# EAGLE design satstep6600 (EAGLE 8.4.3)
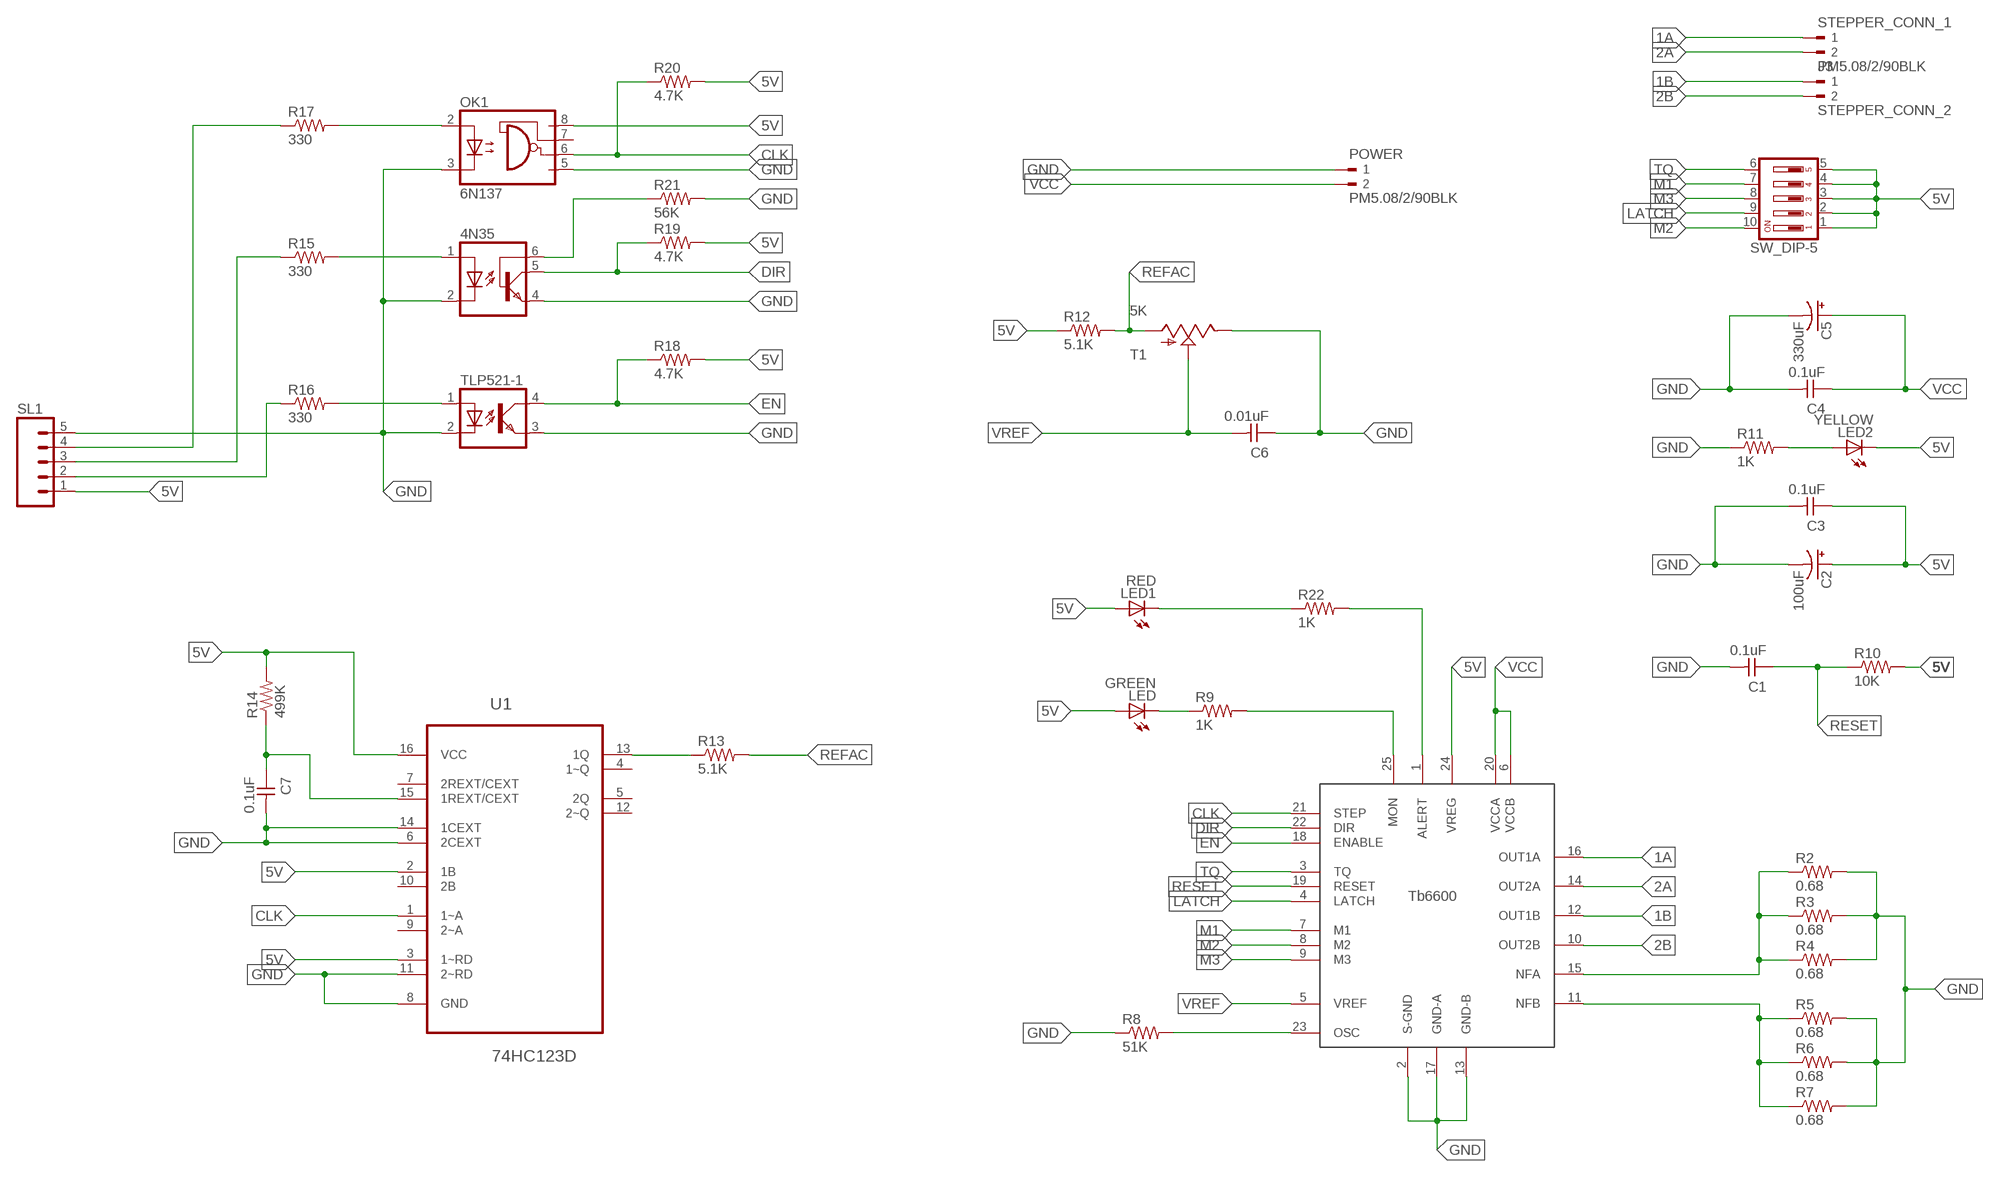
[diagram p0: schematic, sheet 1]

## Parts
4N35  4N35  [DIL06]
C1  0.1uF  UNPOLARIZED_CAPACITOR1206  [1206]
C2  100uF  CAP_POLC  [PANASONIC_C]
C3  0.1uF  UNPOLARIZED_CAPACITOR1206  [1206]
C4  0.1uF  UNPOLARIZED_CAPACITOR1206  [1206]
C5  330uF  CAP_POLPTH3  [CPOL-RADIAL-1000UF-63V]
C6  0.01uF  UNPOLARIZED_CAPACITOR1206  [1206]
C7  0.1uF  UNPOLARIZED_CAPACITOR1206  [1206]
J3  STEPPER_CONN_2  PM5.08/2/90BLK  [WEIDMULLER_PM5.08_2]
LED  GREEN  LED1206  [1206]
LED1  RED  LED1206  [1206]
LED2  YELLOW  LED1206  [1206]
OK1  6N137  [DIL08]
POWER  PM5.08/2/90BLK  [WEIDMULLER_PM5.08_2]
R2  0.68  0.001OHM-3W-1%(2512)3W/1%  [2512]
R3  0.68  0.001OHM-3W-1%(2512)3W/1%  [2512]
R4  0.68  0.001OHM-3W-1%(2512)3W/1%  [2512]
R5  0.68  0.001OHM-3W-1%(2512)3W/1%  [2512]
R6  0.68  0.001OHM-3W-1%(2512)3W/1%  [2512]
R7  0.68  0.001OHM-3W-1%(2512)3W/1%  [2512]
R8  51K  RES-US1206  [R1206]
R9  1K  RES-US1206  [R1206]
R10  10K  RES-US1206  [R1206]
R11  1K  RES-US1206  [R1206]
R12  5.1K  RES-US1206  [R1206]
R13  5.1K  RES-US1206  [R1206]
R14  499K  RES-US1206  [R1206]
R15  330  RES-US1206  [R1206]
R16  330  RES-US1206  [R1206]
R17  330  RES-US1206  [R1206]
R18  4.7K  RES-US1206  [R1206]
R19  4.7K  RES-US1206  [R1206]
R20  4.7K  RES-US1206  [R1206]
R21  56K  RES-US1206  [R1206]
R22  1K  RES-US1206  [R1206]
SL1  M05  [05P]
STEPPER_CONN_1  PM5.08/2/90BLK  [WEIDMULLER_PM5.08_2]
SW_DIP-5  SD4-05  [SD4-05]
T1  5K  TS53YL104MR10-TRIMMER  [TS53YL104MR10_TRIMMER]
TLP521-1  PC817  [DIL04]
U1  74HC123D  [SOIC127P600X175-16N]
U$1  TB6600HG  [P-HZIP25-1.00G]

## Nets
1A: STEPPER_CONN_1.1 U$1.16(OUT1A)
1B: J3.1 U$1.12(OUT1B)
2A: STEPPER_CONN_1.2 U$1.14(OUT2A)
2B: J3.2 U$1.10(OUT2B)
5V: C2.+ C3.1 LED1.1(A) LED2.2(C) LED.1(A) OK1.8(VCC) R10.2 R12.1 R14.2 R18.2 R19.2 R20.2 SL1.1 SW_DIP-5.1 SW_DIP-5.2 SW_DIP-5.3 SW_DIP-5.4 SW_DIP-5.5 U1.2(1B) U1.3(1~RD) U1.16(VCC) U$1.24(VREG)
ALERT: R22.2 U$1.1(ALERT)
CLK: OK1.6(VO) R20.1 U1.1(1~A) U$1.21(STEP)
DIR: 4N35.5(COL) R19.1 U$1.22(DIR)
EN: R18.1 TLP521-1.4(COL) U$1.18(ENABLE)
GND: 4N35.2(C) 4N35.4(EMI) C1.2 C2.- C3.2 C4.2 C5.2(-) C6.1 C7.2 OK1.3(C) OK1.5(GND) POWER.1 R2.2 R3.2 R4.2 R5.2 R6.2 R7.2 R8.1 R11.1 R21.2 SL1.5 T1.P$2(E) TLP521-1.2(C) TLP521-1.3(EMIT) U1.6(2CEXT) U1.8(GND) U1.11(2~RD) U1.14(1CEXT) U$1.2(S-GND) U$1.13(GND-B) U$1.17(GND-A)
LATCH: SW_DIP-5.9 U$1.4(LATCH)
M1: SW_DIP-5.7 U$1.7(M1)
M2: SW_DIP-5.10 U$1.8(M2)
M3: SW_DIP-5.8 U$1.9(M3)
N$1: R5.1 R6.1 R7.1 U$1.11(NFB)
N$2: R8.2 U$1.23(OSC)
N$4: LED.2(C) R9.1
N$5: R2.1 R3.1 R4.1 U$1.15(NFA)
N$6: LED1.2(C) R22.1
N$7: LED2.1(A) R11.2
N$8: R13.1 U1.13(1Q)
N$9: C7.1 R14.1 U1.15(1REXT/CEXT)
N$10: R16.2 TLP521-1.1(A)
N$11: 4N35.1(A) R15.2
N$12: OK1.2(A) R17.2
N$13: 4N35.6(BAS) R21.1
N$14: R16.1 SL1.2
N$15: R15.1 SL1.3
N$16: R17.1 SL1.4
N$19: R9.2 U$1.25(MON)
REFAC: R12.2 R13.2 T1.P$3(A)
RESET: C1.1 R10.1 U$1.19(RESET)
TQ: SW_DIP-5.6 U$1.3(TQ)
VCC: C4.1 C5.1(+) POWER.2 U$1.6(VCCB) U$1.20(VCCA)
VREF: C6.2 T1.P$1(S) U$1.5(VREF)
Unconnected: OK1.7(VE) U1.4(1~Q) U1.5(2Q) U1.7(2REXT/CEXT) U1.9(2~A) U1.10(2B) U1.12(2~Q)

## Library data of the parts
4N35 = optocoupler:4N35: MOTOROLA OPTO COUPLER
C1 C3 C4 C6 C7 = FAB_Hello:UNPOLARIZED_CAPACITOR: unpolarized_capacitor
C2 C5 = SparkFun-Capacitors:CAP_POL: Capacitor Polarized These are standard SMD and PTH capacitors. Normally 10uF, 47uF, and 100uF in electrolytic and tantalum varieties. Always verify the external diameter of the through hole cap, it varies with capacity, voltage, and manufacturer. The EIA devices should be standard.
J3 POWER STEPPER_CONN_1 = WEIDMULLER-PM5.08_2_90BLK:PM5.08/2/90BLK: TERMINAL BLOCK, SIDE ENTRY, 2WAY; MPN: PM5.08/2/90 BLK; OC_FARNELL: 1131855; OC_NEWARK: 26M1980; PACKAGE: TH-R/A; SUPPLIER: WEIDMULLER
LED LED1 LED2 = FAB_Hello:LED
OK1 = optocoupler-2:6N137: MOTOROLA OPTO COUPLER
R2-R7 = SparkFun-Resistors:0.001OHM-3W-1%(2512); PROD_ID: RES-12449; VALUE: 0.001
R8-R22 = fab:RES-US: Resistor (US Symbol) Variants with postfix FAB are widened to allow the routing of internal traces
SL1 = con-amp-quick:M05: AMP QUICK CONNECTOR; OC_FARNELL: unknown; OC_NEWARK: unknown
SW_DIP-5 = switch-dil:SD4-05: DIL/CODE SWITCH; OC_FARNELL: unknown; OC_NEWARK: unknown
T1 = Ava:TS53YL104MR10-TRIMMER
TLP521-1 = optocoupler:PC817: SHARP OPTO COUPLER
U1 = 74HC123D:74HC123D: Dual retriggerable monostable multivibrator with reset; MPN: 74HC123D; OC_FARNELL: 1085332; OC_NEWARK: 99K0580; PACKAGE: SOIC-16; SUPPLIER: NXP
U$1 = tb6600hq:TB6600

## Board
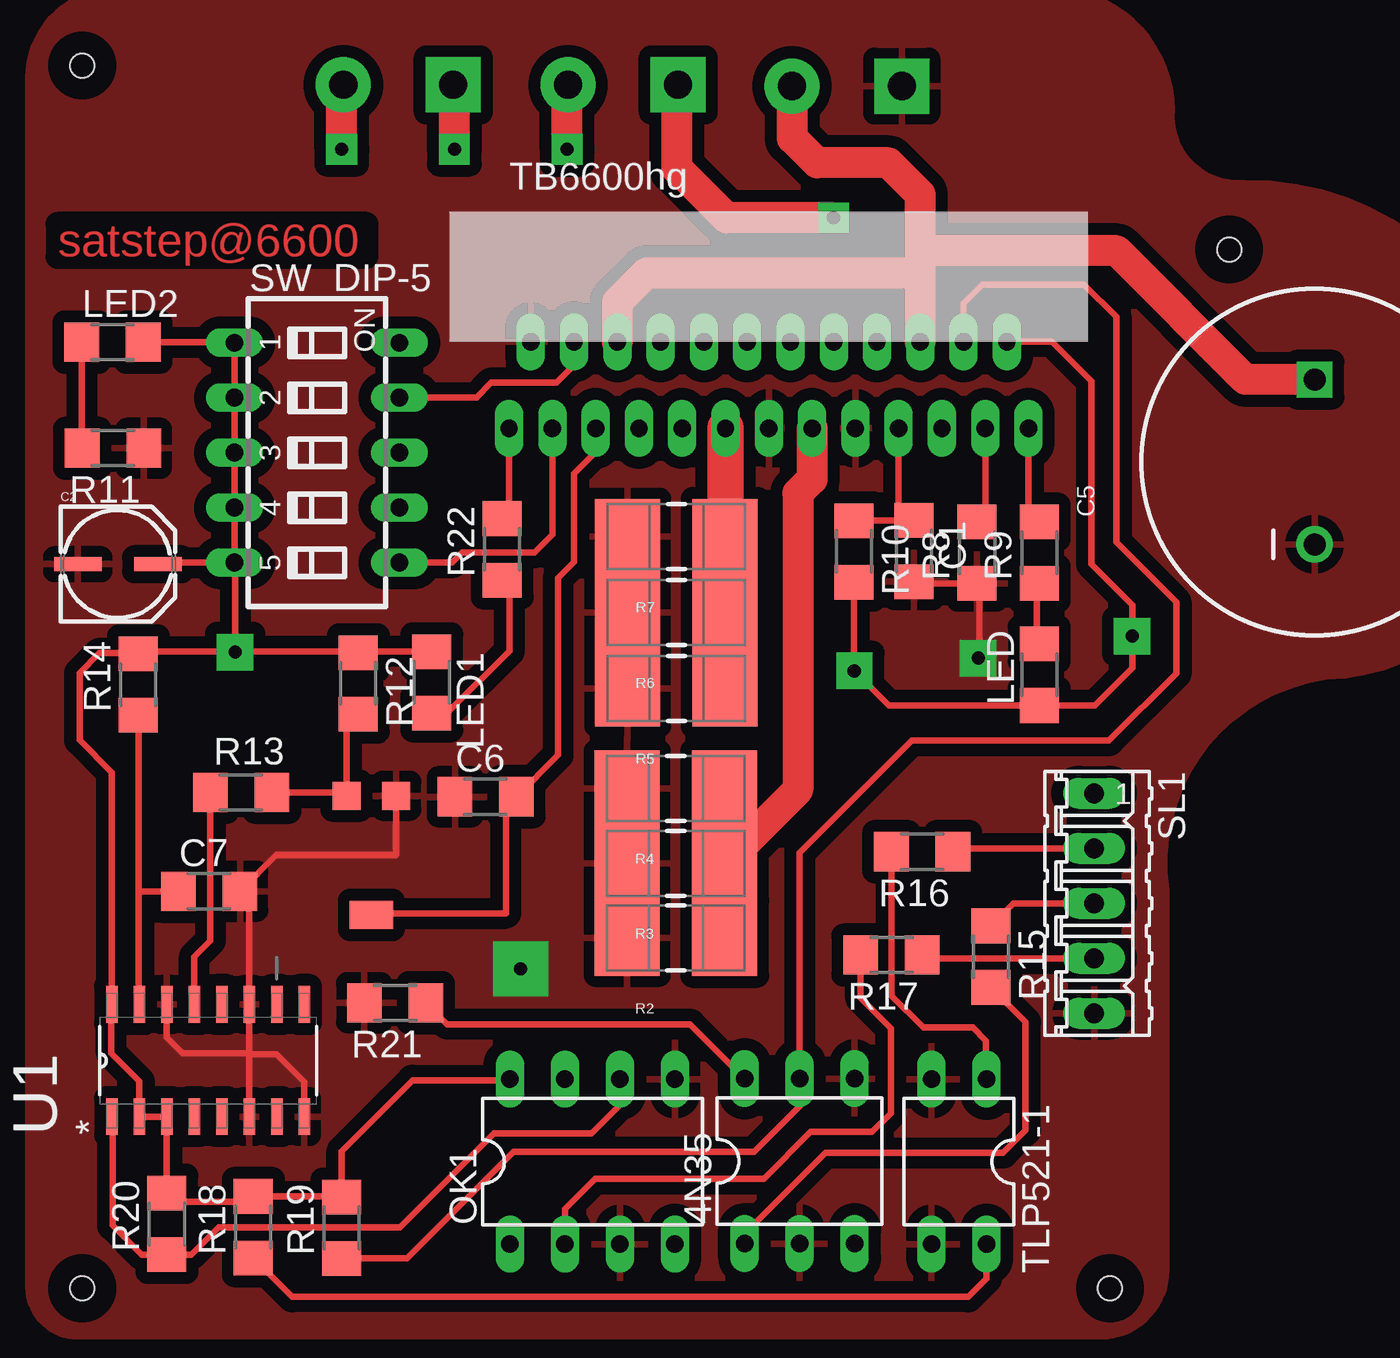
[diagram p1: board, top side]
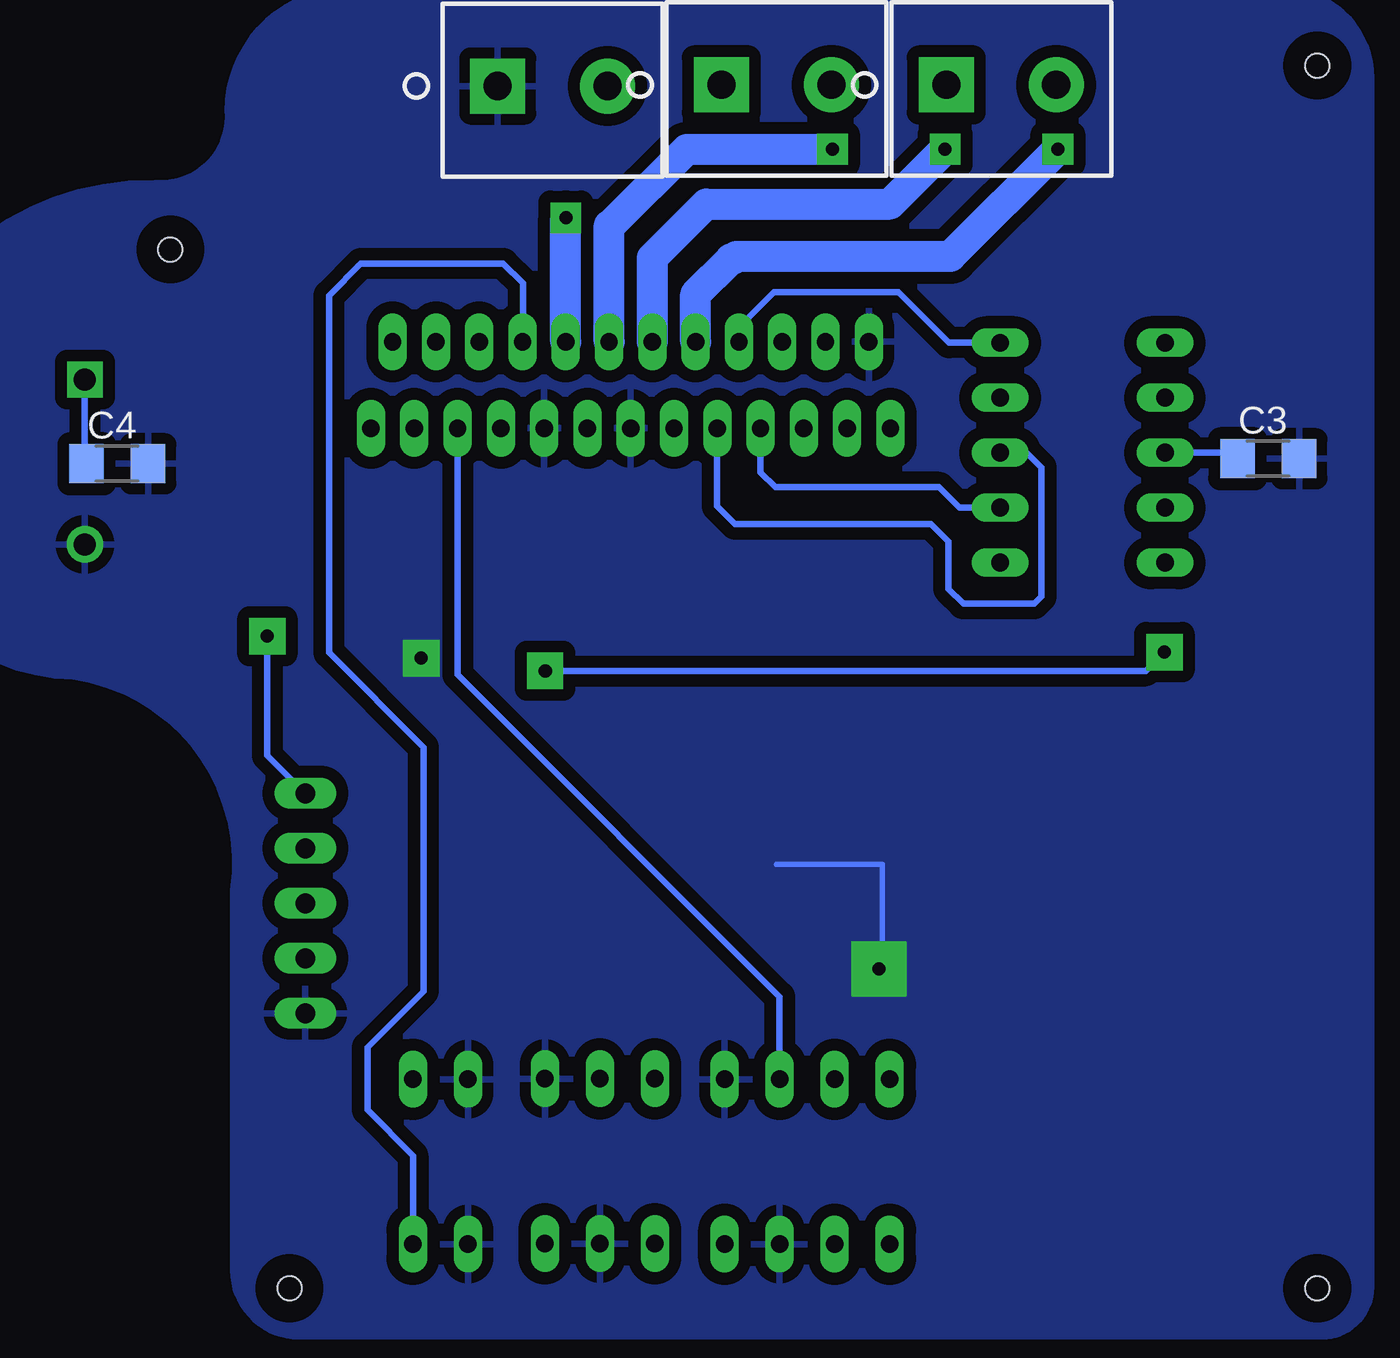
[diagram p2: board, bottom side, seen from below]

No outline drawn. Coordinates in mm, seen from the top.
Copper layers (1*16): Top 0.035mm / dielectric 1.5mm / Bottom 0.035mm
Design rules "default *": minimum track width 10mil, minimum drill 24mil, track to track 8mil, track to pad 8mil, pad to pad 8mil, via to via 8mil, smd to smd 8mil, copper to edge 40mil, drill to drill 8mil, minimum pad ring 10mil, minimum via ring 8mil, stop-mask expansion 4mil, vias tented up to drill 0mil, thermal gap 20mil
Holes 1.1 mm at 3.5,60 3.5,3.5 51,3.5 56.5,51.5

### Footprints (pad centres in the part's own frame; a part is rotated, then mirrored left to right if it is on the bottom)
DIL06 = drill 0.813 long: 1 -2.54,-3.81; 2 0,-3.81; 3 2.54,-3.81; 4 2.54,3.81; 5 0,3.81; 6 -2.54,3.81
1206 = smd 1.6 x 1.803: 1 -1.422,0; 2 1.422,0
PANASONIC_C = smd 2.2 x 0.65: + 1.9,-0.2; - -1.8,-0.2
CPOL-RADIAL-1000UF-63V = drill 1.016 pad 1.651 square: 1 3.81,0 | drill 1.016 pad 1.676: 2 -3.81,0
WEIDMULLER_PM5.08_2 = drill 1.3 pad 2.54 square: 1 -2.54,0 | drill 1.3 pad 2.54: 2 2.54,0
DIL08 = drill 0.813 long: 1 -3.81,-3.81; 2 -1.27,-3.81; 3 1.27,-3.81; 4 3.81,-3.81; 5 3.81,3.81; 6 1.27,3.81; 7 -1.27,3.81; 8 -3.81,3.81
2512 = smd 3 x 3.5: 1 -2.25,0; 2 2.25,0
R1206 = smd 1.6 x 1.803: 1 -1.422,0; 2 1.422,0
05P = drill 0.914 long: 1 -5.08,0; 2 -2.54,0; 3 0,0; 4 2.54,0; 5 5.08,0
SD4-05 = drill 0.813 long: 1 -5.08,-3.81; 2 -2.54,-3.81; 3 0,-3.81; 4 2.54,-3.81; 5 5.08,-3.81; 6 5.08,3.81; 7 2.54,3.81; 8 0,3.81; 9 -2.54,3.81; 10 -5.08,3.81
TS53YL104MR10_TRIMMER = smd 2 x 1.3: P$1 0,2.54 | smd 1.3 x 1.3: P$2 -1.15,-2.96; P$3 1.15,-2.96
DIL04 = drill 0.813 long: 1 -1.27,-3.81; 2 1.27,-3.81; 3 1.27,3.81; 4 -1.27,3.81
SOIC127P600X175-16N = smd 1.702 x 0.533: 1 -2.591,4.445; 2 -2.591,3.175; 3 -2.591,1.905; 4 -2.591,0.635; 5 -2.591,-0.635; 6 -2.591,-1.905; 7 -2.591,-3.175; 8 -2.591,-4.445; 9 2.591,-4.445; 10 2.591,-3.175; 11 2.591,-1.905; 12 2.591,-0.635; 13 2.591,0.635; 14 2.591,1.905; 15 2.591,3.175; 16 2.591,4.445
P-HZIP25-1.00G = drill 0.8 long: 1 -12,-2; 2 -11,2; 3 -10,-2; 4 -9,2; 5 -8,-2; 6 -7,2; 7 -6,-2; 8 -5,2; 9 -4,-2; 10 -3,2; 11 -2,-2; 12 -1,2; 13 0,-2; 14 1,2; 15 2,-2; 16 3,2; 17 4,-2; 18 5,2; 19 6,-2; 20 7,2; 21 8,-2; 22 9,2; 23 10,-2; 24 11,2; 25 12,-2

### Placement (x,y rotation side)
4N35  36.65,9.37 0 top
C1  41.94,37.57 270 top
C2  5.11,37.16 0 top
C3  5.77,41.83 0 bottom
C4  58.95,41.61 0 bottom
C5  60.45,41.68 90 top
C6  22.15,26.21 0 top
C7  9.37,21.84 0 top
J3  18.11,59.11 0 bottom
LED  47.73,31.85 90 top
LED1  19.66,31.5 270 top
LED2  4.9,47.22 0 top
OK1  27.08,9.35 0 top
POWER  38.84,59.05 0 bottom
R2  30.94,19.68 180 top
R3  30.94,23.14 180 top
R4  30.94,26.59 180 top
R5  30.96,31.22 180 top
R6  30.96,34.72 180 top
R7  30.96,38.23 180 top
R8  44.86,37.49 90 top
R9  47.73,37.49 90 top
R10  39.17,37.54 270 top
R11  4.93,42.32 180 top
R12  16.26,31.45 270 top
R13  10.85,26.42 0 top
R14  6.1,31.39 90 top
R15  45.49,18.82 270 top
R16  42.32,23.67 180 top
R17  40.89,18.9 180 top
R18  11.4,6.32 90 top
R19  15.49,6.3 90 top
R20  7.42,6.48 90 top
R21  17.96,16.69 180 top
R22  22.91,37.64 90 top
SL1  50.27,21.29 270 top
STEPPER_CONN_1  28.5,59.11 0 bottom
SW_DIP-5  14.35,42.11 270 top
T1  16.87,23.29 180 top
TLP521-1  44.02,9.35 180 top
U1  9.32,14.02 90 top
U$1  35.23,45.24 0 top

### Tracks (layer width: path | path; a pad name or v marks a point on that pad's centre or on a via)
1A  (via drill 0.6 pad 1.42)
  Top 1.422: v38.23,52.96 33.27,52.96 30.99,55.24 30.99,59.05 STEPPER_CONN_1.1
  Bottom 1.422: U$1.16 v38.23,52.96
1B  (via drill 0.6 pad 1.42)
  Top 1.422: v20.7,56.13 20.7,59.11 J3.1
  Bottom 1.422: U$1.12 34.23,51.11 31.75,53.59 23.24,53.59 v20.7,56.13
2A  (via drill 0.6 pad 1.42)
  Top 1.422: v25.91,56.13 25.91,59.05 STEPPER_CONN_1.2
  Bottom 1.27: 36.23,52.62 36.15,52.62
  Bottom 1.422: U$1.14 36.23,52.62 | v25.91,56.13 32.64,56.13 36.15,52.62
2B  (via drill 0.6 pad 1.42)
  Top 1.422: v15.49,56.13 15.49,59.03 J3.2
  Bottom 1.422: U$1.10 32.23,49.43 30.61,51.05 30.48,51.05 30.35,51.18 20.45,51.18 v15.49,56.13
5V  (via drill 0.6, 0.6 pad 1.68)
  Top 0.305: SW_DIP-5.5 SW_DIP-5.4 SW_DIP-5.3 SW_DIP-5.2 SW_DIP-5.1 10.52,47.22 LED2.2 | C2.+ 7,37.03 SW_DIP-5.5 | 46.26,47.27 U$1.24 48.31,47.24 50.14,45.41 50.14,36.96 52.02,35.08 v52.02,33.63 52.02,32.16 50.29,30.43 LED.1 40.79,30.43 v39.19,32.03 v39.17,32.03 R10.2 39.17,36.58 | SW_DIP-5.5 10.57,37.01 v10.57,32.89 | LED1.1 16.18,32.92 | R12.1 16.23,32.87 16.18,32.92 | 23.24,13.13 OK1.8 23.22,13.11 18.77,13.11 15.49,9.83 R19.2 15.47,7.75 R18.2 11.15,7.49 7.42,7.49 R20.2 U1.3 U1.2 6.15,13.06 4.85,14.35 4.85,16.59 U1.16 4.88,27.33 3.38,28.83 3.38,31.93 4.29,32.84 6.07,32.84 R14.2 6.2,32.92 10.54,32.92 v10.57,32.89 | 16.18,32.92 10.59,32.92 v10.57,32.89
  Bottom 0.305: SW_DIP-5.3 7.19,42.11 C3.1 | v39.17,32.03 11.43,32.03 v10.57,32.89 | v52.02,33.63 52.02,28.12 SL1.1
ALERT
  Top 0.305: R22.2 23.23,39.05 U$1.1
CLK
  Top 0.305: 4.85,11.4 U1.1 4.9,11.4 4.9,6.4 6.25,5.05 R20.1 8.54,5.05 9.8,6.33 18.19,6.33 22.53,10.67 27.05,10.67 28.35,11.96 OK1.6
  Bottom 0.305: 43.26,43.21 U$1.21 43.23,31.85 28.35,16.97 OK1.6
DIR
  Top 0.305: U$1.22 44.23,49.01 45.11,49.89 49.78,49.89 51.28,48.39 51.28,37.97 54.05,35.2 54.05,31.9 50.95,28.8 41.83,28.8 36.65,23.62 4N35.5 | 4N35.5 36.68,13.16 36.68,11.94 34.54,9.8 23.44,9.8 18.52,4.88 R19.1 | 36.63,14.35 36.63,13.21 4N35.5
EN
  Top 0.305: TLP521-1.4 45.29,3.94 44.45,3.1 13.21,3.1 R18.1
  Bottom 0.305: U$1.18 40.21,47.26 40.21,49.94 41.12,50.85 47.7,50.85 49.17,49.38 49.17,32.87 44.81,28.5 44.81,17.22 47.4,14.63 47.4,11.73 45.29,9.63 TLP521-1.4
GND  (via drill 0.6 pad 1.68, 0.6 pad 2.54)
  Top 0.305: C2.- 4.04,36.96 | R8.1 45.26,36.53 | 41.78,36.58 C1.2 | 41.76,35.92 C1.2 | v44.91,32.61 44.96,32.66 44.96,35.97 R8.1 | 41.63,36.04 C1.2 | 44.96,36.04 R8.1 | R8.1 42.01,36.07 C1.2 | T1.P$2 18.02,23.52 12.47,23.52 C7.2 11.23,21.41 U1.11 11.23,14.38 | U1.6 11.23,14.3 | 11.23,14.3 11.23,14.38 | U1.8 13.77,13.03 12.5,14.3 11.23,14.3 | U1.14 7.42,15.09 8.15,14.35 11.2,14.35 11.23,14.38
  Top 1.422: v23.75,18.26 23.67,18.26
  Top 1.676: R7.2 R6.2 R5.2 28.71,31.28 28.73,31.29
  Bottom 0.254: 28.5,23.09 23.6,23.09 23.6,18.2
  Bottom 0.305: 4.04,41.83 C3.2
  pour Top (isolate 0.559): 48.26,63.5 5.08,63.5 arc90 1.02,59.44 1.02,3.56 arc90 3.3,1.27 50.55,1.27 arc90 53.59,4.32 53.59,21.89 arc-90 60.96,31.76 arc90 70.36,41.66 70.36,41.91 arc90 57.21,54.56 56.7,54.56 arc-90 53.85,57.91 arc90
  pour Bottom (isolate 0.559): 48.26,63.5 5.08,63.5 arc90 1.02,59.44 1.02,3.56 arc90 3.3,1.27 50.55,1.27 arc90 53.59,4.32 53.59,21.89 arc-90 60.96,31.76 arc90 70.36,41.66 70.36,41.91 arc90 57.21,54.56 56.7,54.56 arc-90 53.85,57.91 arc90
LATCH
  Top 0.305: SW_DIP-5.9 21.72,44.65 22.4,45.34 25.43,45.34 26.26,46.18 26.26,47.2 U$1.4
M1
  Bottom 0.305: SW_DIP-5.7 20.04,39.57 20.98,40.51 28.55,40.51 29.23,41.2 U$1.7
M2
  Bottom 0.305: 30.25,47.22 U$1.8 30.23,47.9 28.6,49.53 22.86,49.53 20.52,47.19 SW_DIP-5.10
M3
  Bottom 0.305: U$1.9 31.23,39.64 30.4,38.81 21.36,38.81 20.55,38 20.55,35.81 19.86,35.13 16.59,35.13 16.26,35.46 16.26,41.43 16.92,42.09 18.14,42.09 SW_DIP-5.8
N$1
  Top 1.676: U$1.11 33.23,38.24 R7.1 R6.1 R5.1
N$2
  Top 0.305: 45.23,39.42 R8.2 45.23,39.29 U$1.23
N$4
  Top 0.305: R9.1 47.62,36.53 47.62,33.38 LED.2
N$5
  Top 1.422: U$1.15 37.23,40.89 36.58,40.23 36.58,26.53 R3.1 | R3.1 R4.1 | R3.1 R2.1
N$6
  Top 0.305: R22.1 23.24,35.89 23.24,32.94 20.37,30.07 LED1.2
N$7
  Top 0.305: LED2.1 3.48,42.34 R11.2
N$8
  Top 0.305: R13.1 9.42,19.56 8.69,18.82 U1.13
N$9
  Top 0.305: C7.1 6.12,21.84 | 6.12,21.84 6.12,16.61 U1.15 | 6.12,21.84 6.12,29.95 R14.1
N$10
  Top 0.305: TLP521-1.1 45.29,13.79 | 45.29,13.79 45.29,14.3 | 45.29,13.79 45.26,13.82 45.26,14.94 44.65,15.54 42.37,15.54 40.89,17.02 R16.2
N$11
  Top 0.305: 4N35.1 34.11,6.02 37.85,9.75 46.05,9.75 47.09,10.79 47.09,15.8 R15.2
N$12
  Top 0.305: OK1.2 25.81,7.16 27.2,8.56 35,8.56 37.16,10.72 40.01,10.72 40.87,11.58 40.87,15.52 39.47,16.92 R17.2
N$13
  Top 0.305: 4N35.6 31.6,15.7 20.37,15.7 R21.1
N$14
  Top 0.305: R16.1 43.89,23.82 SL1.2
N$15
  Top 0.305: SL1.3 46.53,21.29 R15.1
N$16
  Top 0.305: R17.1 42.39,19.13 42.77,18.75 SL1.4
N$19
  Top 0.305: 47.23,39.26 R9.2 47.23,39.41 U$1.25
REFAC
  Top 0.305: R12.2 | 16.3,29.98 R12.2 | T1.P$3 15.72,30.02 R12.2 | 15.7,26.26 T1.P$3 | 15.65,26.31 T1.P$3 | R13.2 15.55,26.42 T1.P$3
RESET
  Top 0.305: U$1.19 41.23,39.69 C1.1 41.91,38.96 R10.1
TQ
  Top 0.305: SW_DIP-5.6 20.6,37.03 21.06,37.49 24.41,37.49 25.25,38.33 25.25,43.22 U$1.3
VCC
  Top 1.422: U$1.20 42.23,50.42 | 42.23,50.42 42.23,51.44 | 42.23,51.44 42.23,54.04 40.77,55.5 37.47,55.5 36.32,56.64 36.32,59.03 POWER.2 | 42.23,50.42 29.59,50.42 28.23,49.06 U$1.6 | C5.1 57.25,45.49 51.31,51.44 42.23,51.44
  Bottom 0.305: 60.45,41.23 C4.1 60.45,41.68 C5.1
VREF
  Top 0.305: U$1.5 27.23,42.14 26.24,41.15 26.24,37.06 25.5,36.32 25.5,28.14 C6.2 | 23.09,26.64 C6.2 | T1.P$1 16.87,20.83 23.09,20.83 23.09,25.73 C6.2

### Text on the board
Top: satstep@6600